# Altium schematic sheet nixieClockSchematic.SchDoc
size 420 x 297 mm; SheetNumber: 1; SheetTotal: 1
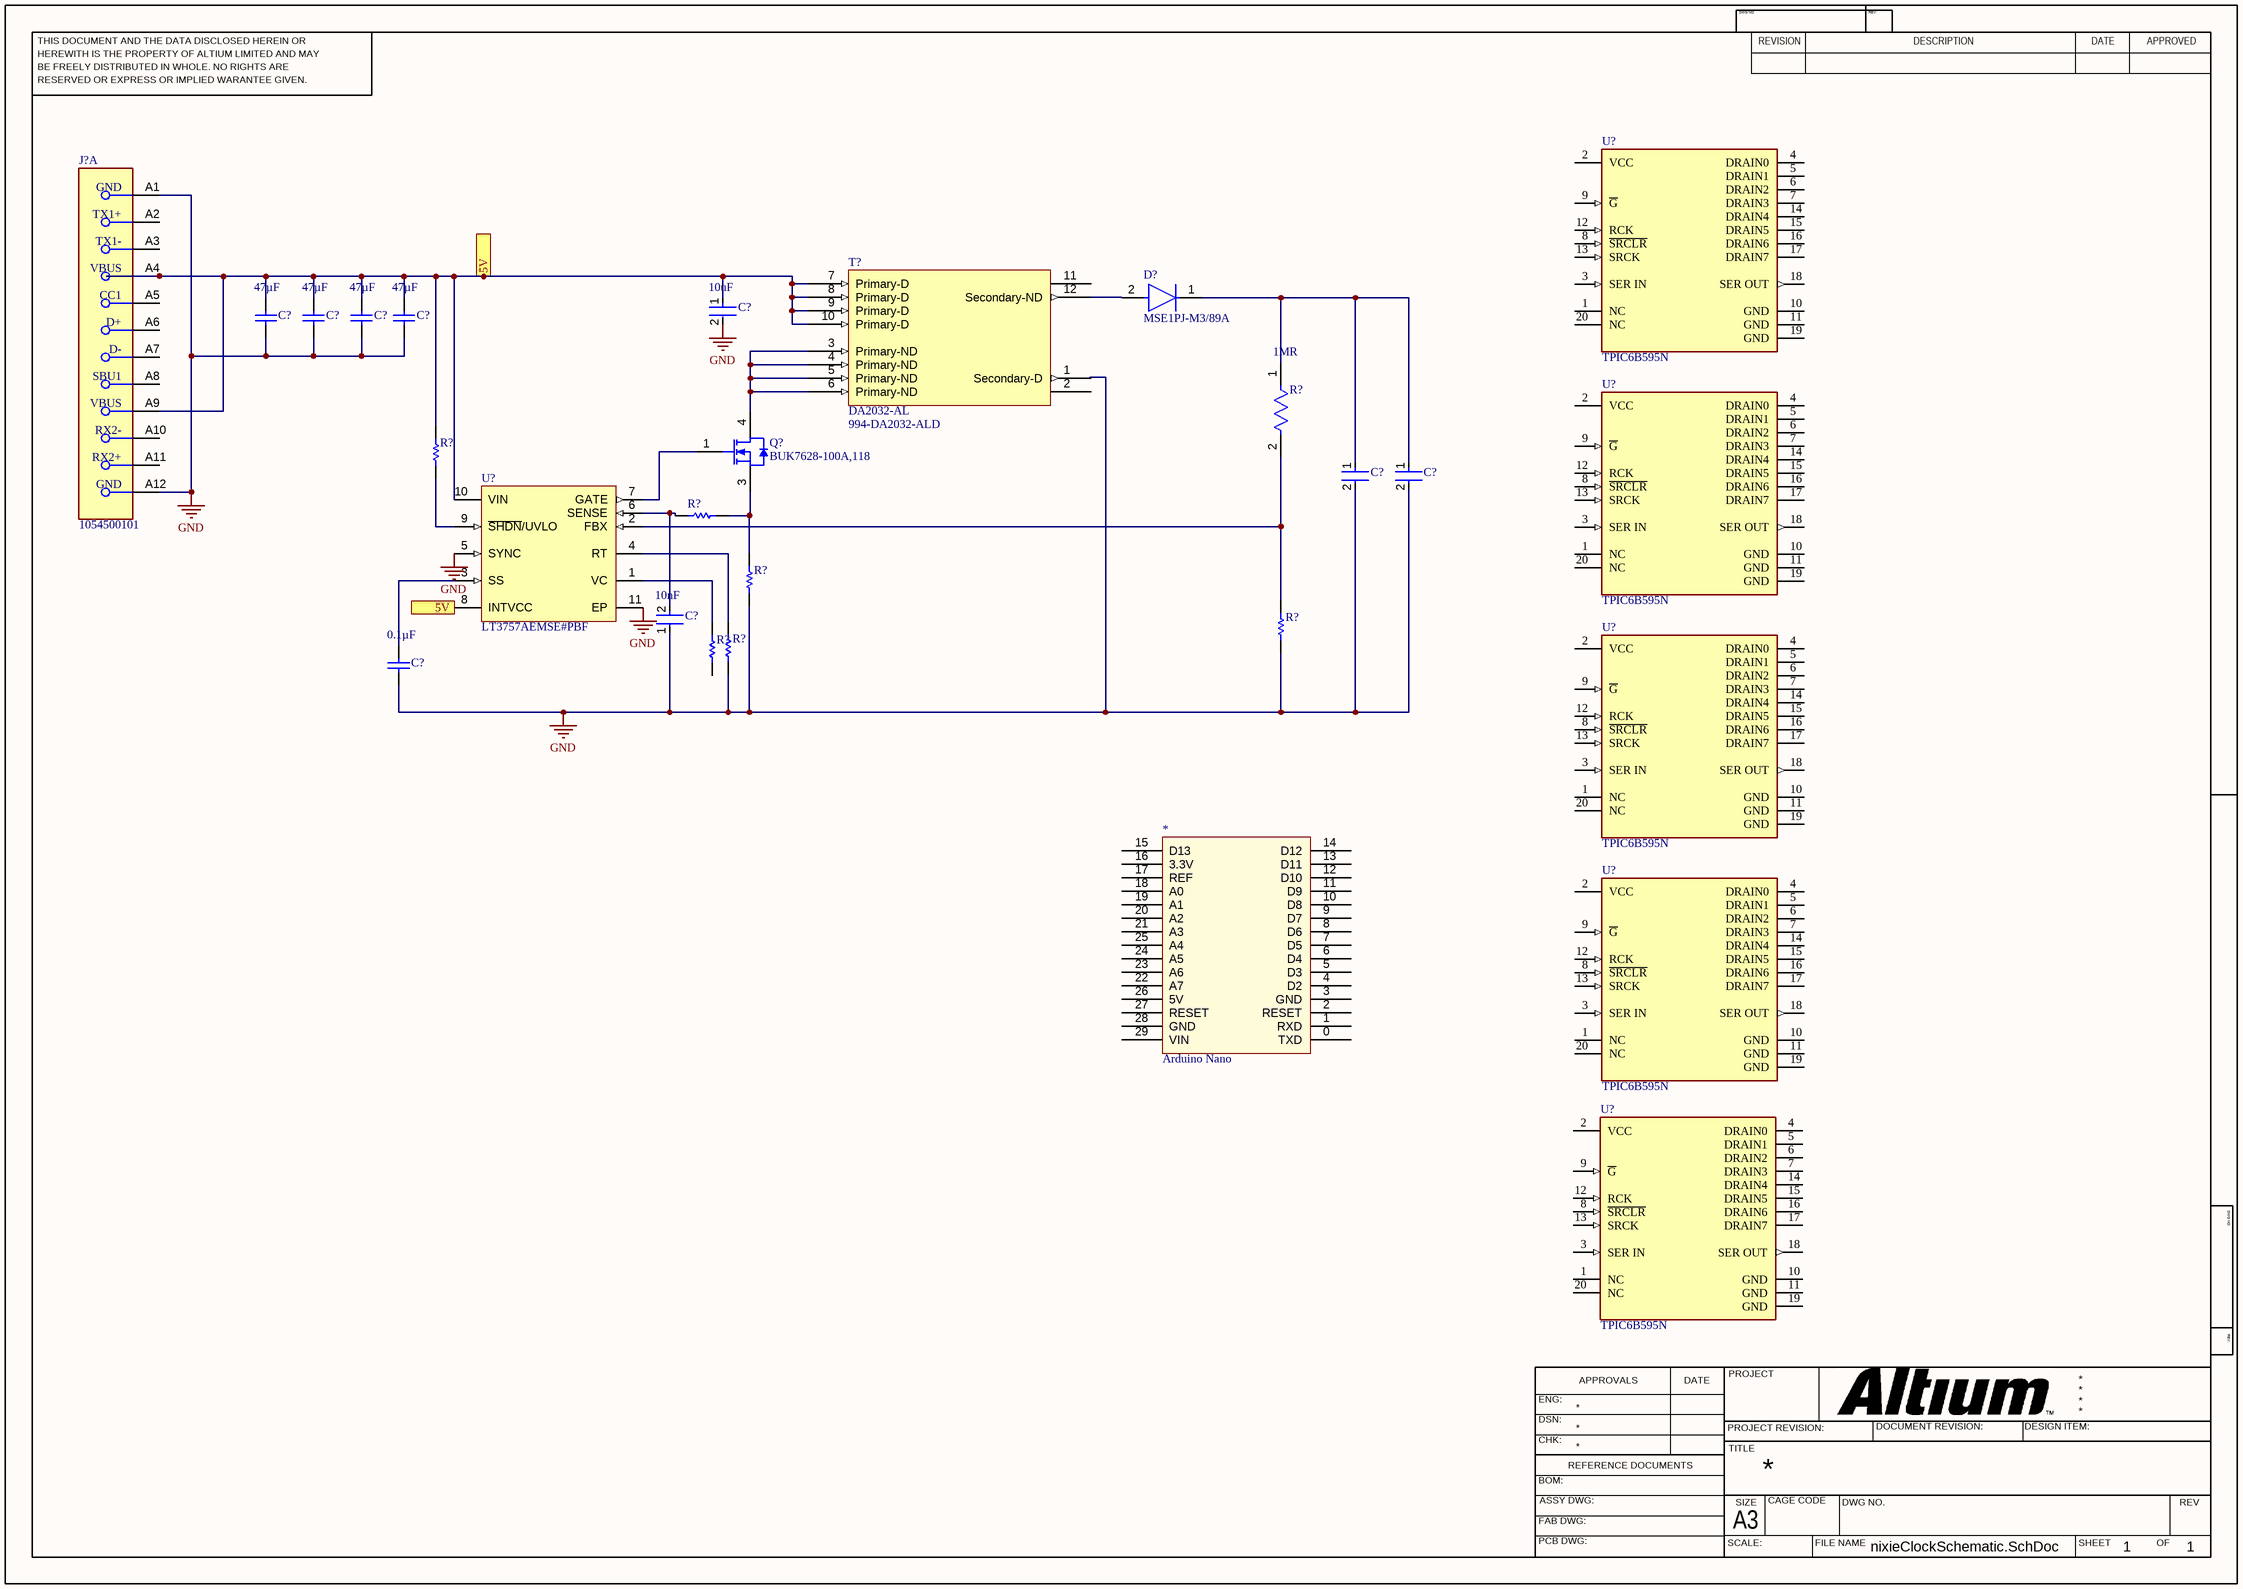
[diagram p0: nixieClockSchematic.SchDoc]

## Parts
(Parts that share a designator on the sheet are numbered #1, #2 ... from top to bottom, then left to right.)
*  Arduino Nano  [Arduino Nano - duplicate]
C?#1  Capacitance: 47µF  [MURA-1210_H_2.7_L]  (hidden comment: GRM32ER61C476KE15L)
C?#2  Capacitance: 47µF  [MURA-1210_H_2.7_L]  (hidden comment: GRM32ER61C476KE15L)
C?#3  Capacitance: 47µF  [MURA-1210_H_2.7_L]  (hidden comment: GRM32ER61C476KE15L)
C?#4  Capacitance: 47µF  [MURA-1210_H_2.7_L]  (hidden comment: GRM32ER61C476KE15L)
C?#5  Capacitance: 10uF  [FP-CL21-IPC_A]  (hidden comment: CL21A106KOQNNNG)
C?#6  QMK325B7224MNHT  [FP-1210-L_3_2_0_3-W_2_5_0-MFG]  (value not drawn)
C?#7  QMK325B7224MNHT  [FP-1210-L_3_2_0_3-W_2_5_0-MFG]  (value not drawn)
C?#8  Capacitance: 10nF  [FP-C1608-080-0_1-IPC_C]  (hidden comment: C1608X7R2A103M080AA)
C?#9  Capacitance: 0.1µF  [KEMT-1206-2_M]  (hidden comment: C1206C104K5RACTU)
D?  MSE1PJ-M3/89A  [FP-MSE1PJ-M3-89A-MFG]
J?  1054500101  [FP-1054500101-MFG]  (part A of 3)
Q?  BUK7628-100A,118  [NXP-SOT404_M]
R?#1  Resistance: 1MR  [FP-RMCF0402-IPC_B]  (hidden comment: RMCF0402JT1M00)
R?#2  ERJ-6ENF1403V  [RESC2013X70X40LL20T20]  (value not drawn)
R?#3  ERJ8ENF22R0V  [RESC3216X70X50LL05T20]  (value not drawn)
R?#4  PRL1632-R020-F-T1  [RESC3216X60X45ML20T15]  (value not drawn)
R?#5  RE0402FRE0710KL  [RESC1005X37X25LL05T10]  (value not drawn)
R?#6  RE0402FRE0710KL  [RESC1005X37X25LL05T10]  (value not drawn)
R?#7  ERJ-6ENF1403V  [RESC2013X70X40LL20T20]  (value not drawn)
T?  DA2032-AL  Supplier Part Number 1: 994-DA2032-ALD  [DA2032AL]
U?#1  TPIC6B595N  [FP-N0020A-MFG]
U?#2  TPIC6B595N  [FP-N0020A-MFG]
U?#3  LT3757AEMSE#PBF  [LT-MSE-10-EDP_N]
U?#4  TPIC6B595N  [FP-N0020A-MFG]
U?#5  TPIC6B595N  [FP-N0020A-MFG]
U?#6  TPIC6B595N  [FP-N0020A-MFG]

## Ports
5V

## Nets
GND: C?#1.2 C?#2.2 C?#3.2 C?#4.2 C?#5.2 C?#6.2 C?#7.2 C?#8.1 C?#9.2 J?.A1(GND) J?.A12(GND) R?#4.1 R?#5.1 R?#7.1 U?#3.5(SYNC) U?#3.11(EP)
5V: C?#1.1 C?#2.1 C?#3.1 C?#4.1 C?#5.1 J?.A4(VBUS) J?.A9(VBUS) R?#2.2 T?.7(Primary-D) T?.8(Primary-D) T?.9(Primary-D) T?.10(Primary-D) U?#3.8(INTVCC) U?#3.10(VIN) ; port 5V
NetC?#6_1: C?#6.1 C?#7.1 D?.1(C) R?#1.1
NetC?#8_2: C?#8.2 R?#3.1 U?#3.6(SENSE)
NetC?#9_1: C?#9.1 U?#3.3(SS)
NetD?_2: D?.2(A) T?.12(Secondary-ND)
NetQ?_1: Q?.1(G) U?#3.7(GATE)
NetQ?_3: Q?.3(S) R?#3.2 R?#4.2
NetQ?_4: Q?.4(D) T?.3(Primary-ND) T?.4(Primary-ND) T?.5(Primary-ND) T?.6(Primary-ND)
NetR?#1_2: R?#1.2 R?#5.2 U?#3.2(FBX)
NetR?#2_1: R?#2.1 U?#3.9(~{SHDN}/UVLO)
NetR?#6_2: R?#6.2 U?#3.1(VC)
NetR?#7_2: R?#7.2 U?#3.4(RT)

Not connected (* = marked no-connect by the designer): * 0(TXD) 1(RXD) 2(RESET) 3(GND) 4(D2) 5(D3) 6(D4) 7(D5) 8(D6) 9(D7) 10(D8) 11(D9) 12(D10) 13(D11) 14(D12) 15(D13) 16(3.3V) 17(REF) 18(A0) 19(A1) 20(A2) 21(A3) 22(A7) 23(A6) 24(A5) 25(A4) 26(5V) 27(RESET) 28(GND) 29(VIN); J? A2(TX1+) A3(TX1-) A5(CC1) A6(D+) A7(D-) A8(SBU1) A10(RX2-) A11(RX2+); R?#6 1; T? 1(Secondary-D) 2 11; U?#1 1(NC) 2(VCC) 3(SER_IN) 4(DRAIN0) 5(DRAIN1) 6(DRAIN2) 7(DRAIN3) 8(~{SRCLR}) 9(~{G}) 10(GND) 11(GND) 12(RCK) 13(SRCK) 14(DRAIN4) 15(DRAIN5) 16(DRAIN6) 17(DRAIN7) 18(SER_OUT) 19(GND) 20(NC); U?#2 1(NC) 2(VCC) 3(SER_IN) 4(DRAIN0) 5(DRAIN1) 6(DRAIN2) 7(DRAIN3) 8(~{SRCLR}) 9(~{G}) 10(GND) 11(GND) 12(RCK) 13(SRCK) 14(DRAIN4) 15(DRAIN5) 16(DRAIN6) 17(DRAIN7) 18(SER_OUT) 19(GND) 20(NC); U?#4 1(NC) 2(VCC) 3(SER_IN) 4(DRAIN0) 5(DRAIN1) 6(DRAIN2) 7(DRAIN3) 8(~{SRCLR}) 9(~{G}) 10(GND) 11(GND) 12(RCK) 13(SRCK) 14(DRAIN4) 15(DRAIN5) 16(DRAIN6) 17(DRAIN7) 18(SER_OUT) 19(GND) 20(NC); U?#5 1(NC) 2(VCC) 3(SER_IN) 4(DRAIN0) 5(DRAIN1) 6(DRAIN2) 7(DRAIN3) 8(~{SRCLR}) 9(~{G}) 10(GND) 11(GND) 12(RCK) 13(SRCK) 14(DRAIN4) 15(DRAIN5) 16(DRAIN6) 17(DRAIN7) 18(SER_OUT) 19(GND) 20(NC); U?#6 1(NC) 2(VCC) 3(SER_IN) 4(DRAIN0) 5(DRAIN1) 6(DRAIN2) 7(DRAIN3) 8(~{SRCLR}) 9(~{G}) 10(GND) 11(GND) 12(RCK) 13(SRCK) 14(DRAIN4) 15(DRAIN5) 16(DRAIN6) 17(DRAIN7) 18(SER_OUT) 19(GND) 20(NC)

## Notes on the sheet
- THIS DOCUMENT AND THE DATA DISCLOSED HEREIN OR
- HEREWITH IS THE PROPERTY OF ALTIUM LIMITED AND MAY
- DWG NO:
- REVISION
- REV:
- DESCRIPTION
- DATE
- APPROVED
- BE FREELY DISTRIBUTED IN WHOLE. NO RIGHTS ARE
- RESERVED OR EXPRESS OR IMPLIED WARANTEE GIVEN.
- ENG:
- APPROVALS
- PROJECT
- DSN:
- CHK:
- REFERENCE DOCUMENTS
- PROJECT REVISION:
- TITLE
- DOCUMENT REVISION:
- DESIGN ITEM:
- BOM:
- FAB DWG:
- PCB DWG:
- ASSY DWG:
- SCALE:
- A3
- SIZE
- CAGE CODE
- FILE NAME
- DWG NO.
- SHEET
- OF
- REV

## Library data of the parts
C?#1-C?#4 = CMP-2000-06362-1: Cap Ceramic, 47 uF, +/- 10%, -55 to 85 degC, 2-Pin SMD (1210), RoHS, Tape and Reel; Manufacturer: Murata; Catalog Drawings: GRMSeries_1210_2.5; Voltage Rating DC: 16V; Product Training Modules: High-CapMultilayerCeramicCapacitors; Temperature Coefficient: X5R; Online Catalog: GRMSeries; Other Names: 490-6539-6; Lead Style: -; Datasheet URL: http://psearch.en.murata.com/capacitor/product/GRM32ER61C476KE15%23.pdf; Package Description: 2-Pin Surface Mount Device, Body 3.2 x 2.5 mm; Applications: GeneralPurpose; Thickness (Max): 0.106"(2.70mm); Operating Temperature: -55°C~85°C; Mounting Technology: SurfaceMount; Category: Capacitors; Package / Case: 1210(3225Metric); Mounting Type: SurfaceMount,MLCC; Ratings: -; Package Reference: 1210; Height - Seated (Max): -; Series: GRM; Lead Spacing: -; Family: CeramicCapacitors; Datasheet Version: 04/2016; Tolerance: ±10%; Size / Dimension: 0.126"Lx0.098"W(3.20mmx2.50mm); Packaging: Digi-Reel®; Voltage - Rated: 16V; Standard Package: 1; Features: -; Manufacturer URL: http://www.murata.com/
C?#5 = CMP-13271-002240-1: CL21 Series 0805 10uF 16V ±10% Tolerance X5R Multilayer Ceramic Chip Capacitor; Case Code (Metric): 2012; Package Quantity: 3000; Width: 0.049inch; Mount: Surface Mount; Depth: 1.25mm; Material: Ceramic; Min Operating Temperature: -55°C; Thickness: 0.053inch; Tolerance: 10%; Case Code (Imperial): 0805; Packaging: Tape and Reel; Voltage Rating: 16V; Case/Package: 0805; Height: 1.25mm; Voltage: 16V; Max Operating Temperature: 85°C; Length: 2mm; Dielectric: X5R
C?#6 C?#7 = CMP-14477-001641-2: None; RoHS Compliant: Yes
C?#8 = CMP-08246-003966-1: Multilayer Ceramic Capacitors 10nF ±20% 100V X7R SMD 0603; Construction: Flat; Tolerance: 20%; Case Code (Metric): 1608; Series: C; Dielectric: X7R; Max Operating Temperature: 125°C; Case/Package: 0603; Height: 0.8mm; Termination: SMD/SMT; RoHS Compliant: Yes; Weight: 7.1E-05oz; Resistor Type: Ceramic; Min Operating Temperature: -55°C; REACH SVHC: No SVHC; Depth: 0.8mm; Package Quantity: 1; Voltage Rating: 100V; Case Code (Imperial): 0603; Mount: Surface Mount; Number of Pins: 2; Length: 1.6mm; Packaging: Tape and Reel; Voltage Rating (DC): 100V; Width: 0.031inch; Thickness: 0.037inch
C?#9 = CMP-1037-04202-2: CAP, Ceramic, 0.1 uF, +/- 10%, 50 V, -55 to 125 degC, 1206 (3216 Metric), RoHS, Tape and Reel; Manufacturer: Kemet; Voltage Rating: 50V; Product Range: KEMET-CSeries; SVHC: ToBeAdvised; Dielectric Characteristic: X7R; Capacitor Case Style: 1206[3216Metric]; Package Reference: 1206-2; Package Description: 2-Leads SMD, Body 3.2 x 1.6 mm; Packaging: Tape&Reel; Operating Temperature Max: 125degC; Capacitance Tolerance: ±10%; Datasheet URL: https://datasheet.ciiva.com/6125/1725438-6125494.pdf; Manufacturer URL: http://www.kemet.com/; Operating Temperature Min: -55degC; Datasheet Version: Jul-13
D? = CMP-02540-000023-1: DIODE GEN PURP 600V 1A MICROSMP; Manufacturer: Vishay; Max Junction Temp: +175°C; Max Surge Forward Current: 20A; Value: 5pF; Description: Diode Switching 600V 1A 2-Pin Micro SMP T/R; Peak Reverse Current: 1uA; Digikey Description: DIODE GEN PURP 600V 1A MICROSMP; Mouser Description: Rectifiers 1.0 Amp 600 Volt 20 Amp IFSM; Package: MSE1PJ-M3/89A; Temperature Range Low: -55°C; Device Class L2: Diodes; Forward Current: 1A; ComponentLink2Description: Datasheet; Lead Free: Yes; Temperature: -55°C to +175°C; RoHS: TRUE; Temperature Range High: +175°C; Max Repetitive Reverse Voltage: 600V; Height: 0.73mm; Capacitance: 5pF; Octopart: https://octopart.com/mse1pj-m3%2F89a-vishay-42669385; Device Class L1: Discrete Semiconductors; ComponentLink2URL: https://www.vishay.com/docs/89067/mse1pj.pdf; Category: Diode; Device Class L3: Rectifier Diodes; Automotive: No; Manufacturer Part Number: MSE1PJ-M3/89A
J? = CMP-04767-000004-1: CONN RCP USB3.1 TYPEC 24P SMD RA; Manufacturer: Molex; Number Of Contacts: 24; Voltage Rating: 30V; Shielding: true; Is Female: yes; Current Rating: 0.25/1.25/5A; Pitch: 0.5mm; Conn Orientation: Right Angle; Package: 0; Height: 3.44mm; Footprint Url: https://www.molex.com/pdm_docs/sd/1054500101_sd.pdf; Device Class L1: Connectors; Category: Conn; Device Class L2: USB Connectors; Digikey Description: CONN RCP USB3.1 TYPEC 24P SMD RA; Contact Material: Gold,Nickel; Mouser Description: USB Shielded I/O Receptacle; Type C; Right Angle; Surface Mount; Gold over Nickel; ComponentLink2Description: Datasheet; Lead Free: Yes; Automotive: No; Temperature Range High: +85°C; RoHS: TRUE; Octopart: https://octopart.com/105450-0101-molex-68082325; ComponentLink2URL: https://www.molex.com/webdocs/datasheets/pdf/en-us/1054500101_IO_CONNECTORS.pdf; Temperature: -30°C to +85°C; Usb Standard: USB 3.1; Temperature Range Low: -30°C; Device Class L3: unset; Manufacturer Part Number: 1054500101
Q? = CMP-1259-00216-1: N-Channel TrenchMOS Standard Level FET, 100 V, 47 A, 3-Pin SOT404, Tape and Reel; Manufacturer: NXP Semiconductors; VGSth [typ] (V): 3; Automotive Qualified: Y; Packing: Tape & Reel; VDS [max] (V): 100; ID [max] (A): 47; Channel Type: N; Qr [typ] (nC): 240; IDM [max] (A): 187; PackageDescription: 3-Pin Plastic Single-ended Surface Mounted Package, Body 10 x 9.6 mm, Pitch 2.54 mm; ComponentLink3URL: http://www.nxp.com/documents/outline_drawing/sot404_po.pdf; PackageVersion: 13-02-25, 02/2013; Mounting Technology: Surface Mount; DatasheetVersion: Rev. 2; ComponentLink3Description: Package Specification; ComponentLink1Description: Manufacturer URL; ComponentLink2URL: http://www.nxp.com/documents/data_sheet/BUK7628-100A.pdf; PackageReference: SOT404; ComponentLink2Description: Datasheet; ComponentLink1URL: http://www.nxp.com/; PartNumber: BUK7628-100A,118
R?#1 = CMP-26527-001513-1: 1MΩ ±5% 0.063W 0402 Thick Film Chip Resistor AEC-Q200 compliant; Power Rating: 63mW; Temperature Coefficient: 100ppm/°C; Working Voltage: 50V; Number of Terminations: 2; Resistor Type: Thick Film; Case/Package: 0402; Length: 0.039inch; Min Operating Temperature: -55°C; Mount: Surface Mount; Max Operating Temperature: 155°C; Depth: 0.5mm; Height: 0.016inch; Tolerance: 5%; RoHS Compliant: Yes; Construction: Rectangular; Contact Plating: Tin; Case Code (Imperial): 0402; Features: Automotive AEC-Q200; Radiation Hardening: No; Military Standard: Not; Case Code (Metric): 1005; Max Power Dissipation: 63mW; Packaging: Tape and Reel; Series: RMCF; Lead Free: Lead Free; Technology: THICK FILM; Width: 0.02inch
R?#2 R?#7 = CMP-2001-04430-1: 140K; Manufacturer: Panasonic; Part Number: ERJ-6ENF1403V
R?#3 = CMP-1014-00320-2: Manufacturer: Panasonic; Part Number: ERJ8ENF22R0V
R?#4 = CMP-2003-04773-1: Manufacturer: Susumu; Part Number: PRL1632-R020-F-T1
R?#5 R?#6 = CMP-2002-01842-1: Manufacturer: Yageo; Part Number: RE0402FRE0710KL
T? = DA2032-AL: Transformer; Supplier 1: Mouser
U?#1 U?#2 U?#4-U?#6 = CMP-04904-000007-1: IC PWR 8-BIT SHIFT REGIS 20-DIP; Propagation Delay: 200ns; Direction: Unidirectional; Number of Bits: 8; Max Supply Voltage: 5.5V; Operating Supply Voltage: 5V; Logic Function: Shift Register; Output Voltage: 50V; Number of Circuits: 1; Number of Output Lines: 9; Min Supply Voltage: 4.5V; Min Operating Temperature: -40°C; Number of Pins: 20; Weight: 0.042297oz; Case/Package: PDIP; Package Quantity: 20; Number of Bits per Element: 8; Packaging: Rail/Tube; Height: 4.57mm; Radiation Hardening: No; Length: 24.33mm; REACH SVHC: No SVHC; Width: 6.35mm; Lead Free: Lead Free; Number of Elements: 1; Number of Outputs: 8; Max Operating Temperature: 125°C; RoHS Compliant: Yes; Contact Plating: Gold; Number of Input Lines: 1; Mount: Through Hole; Turn-On Delay Time: 200ns
U?#3 = CMP-0491-01033-1: Boost, Flyback, SEPIC and Inverting Controller-Improved Load Transient, 10-pin SOP (MSE-10-EDP), -40 to 125 degC, Pb-Free; Manufacturer: Linear Technology; Frequency Adjust Range: 100kHz - 1MHz; Number of Outputs: 1; PackageVersion: Rev. I, 05/2013; PackageDescription: 10-Pin Plastic MSOP, Exposed Die Pad, Body 3 x 3 mm, Pitch 0.5 mm; PackageReference: MSE-10; DatasheetVersion: Rev. D; ComponentLink1Description: Manufacturer URL; PartNumber: LT3757AEMSE#PBF; ComponentLink2URL: http://cds.linear.com/docs/en/datasheet/3757Afd.pdf; RoHS: TRUE; ComponentLink3Description: Package Specification; ComponentLink1URL: http://www.linear.com/; Mounting Technology: Surface Mount; ComponentLink2Description: Datasheet; ComponentLink3URL: http://cds.linear.com/docs/en/packaging/05081664_I_MSE.pdf